# EasyEDA Pro project car1.eprj, schematic Schematic9
Board Name: V2.0-电源板; Create Date: 2025-06-19; Page Name: P1; Project Name: car1; Schematic Name: Schematic9; Update Date: 2025-06-21; Company: 嘉立创EDA; Page Size: A4; Version: V1.0
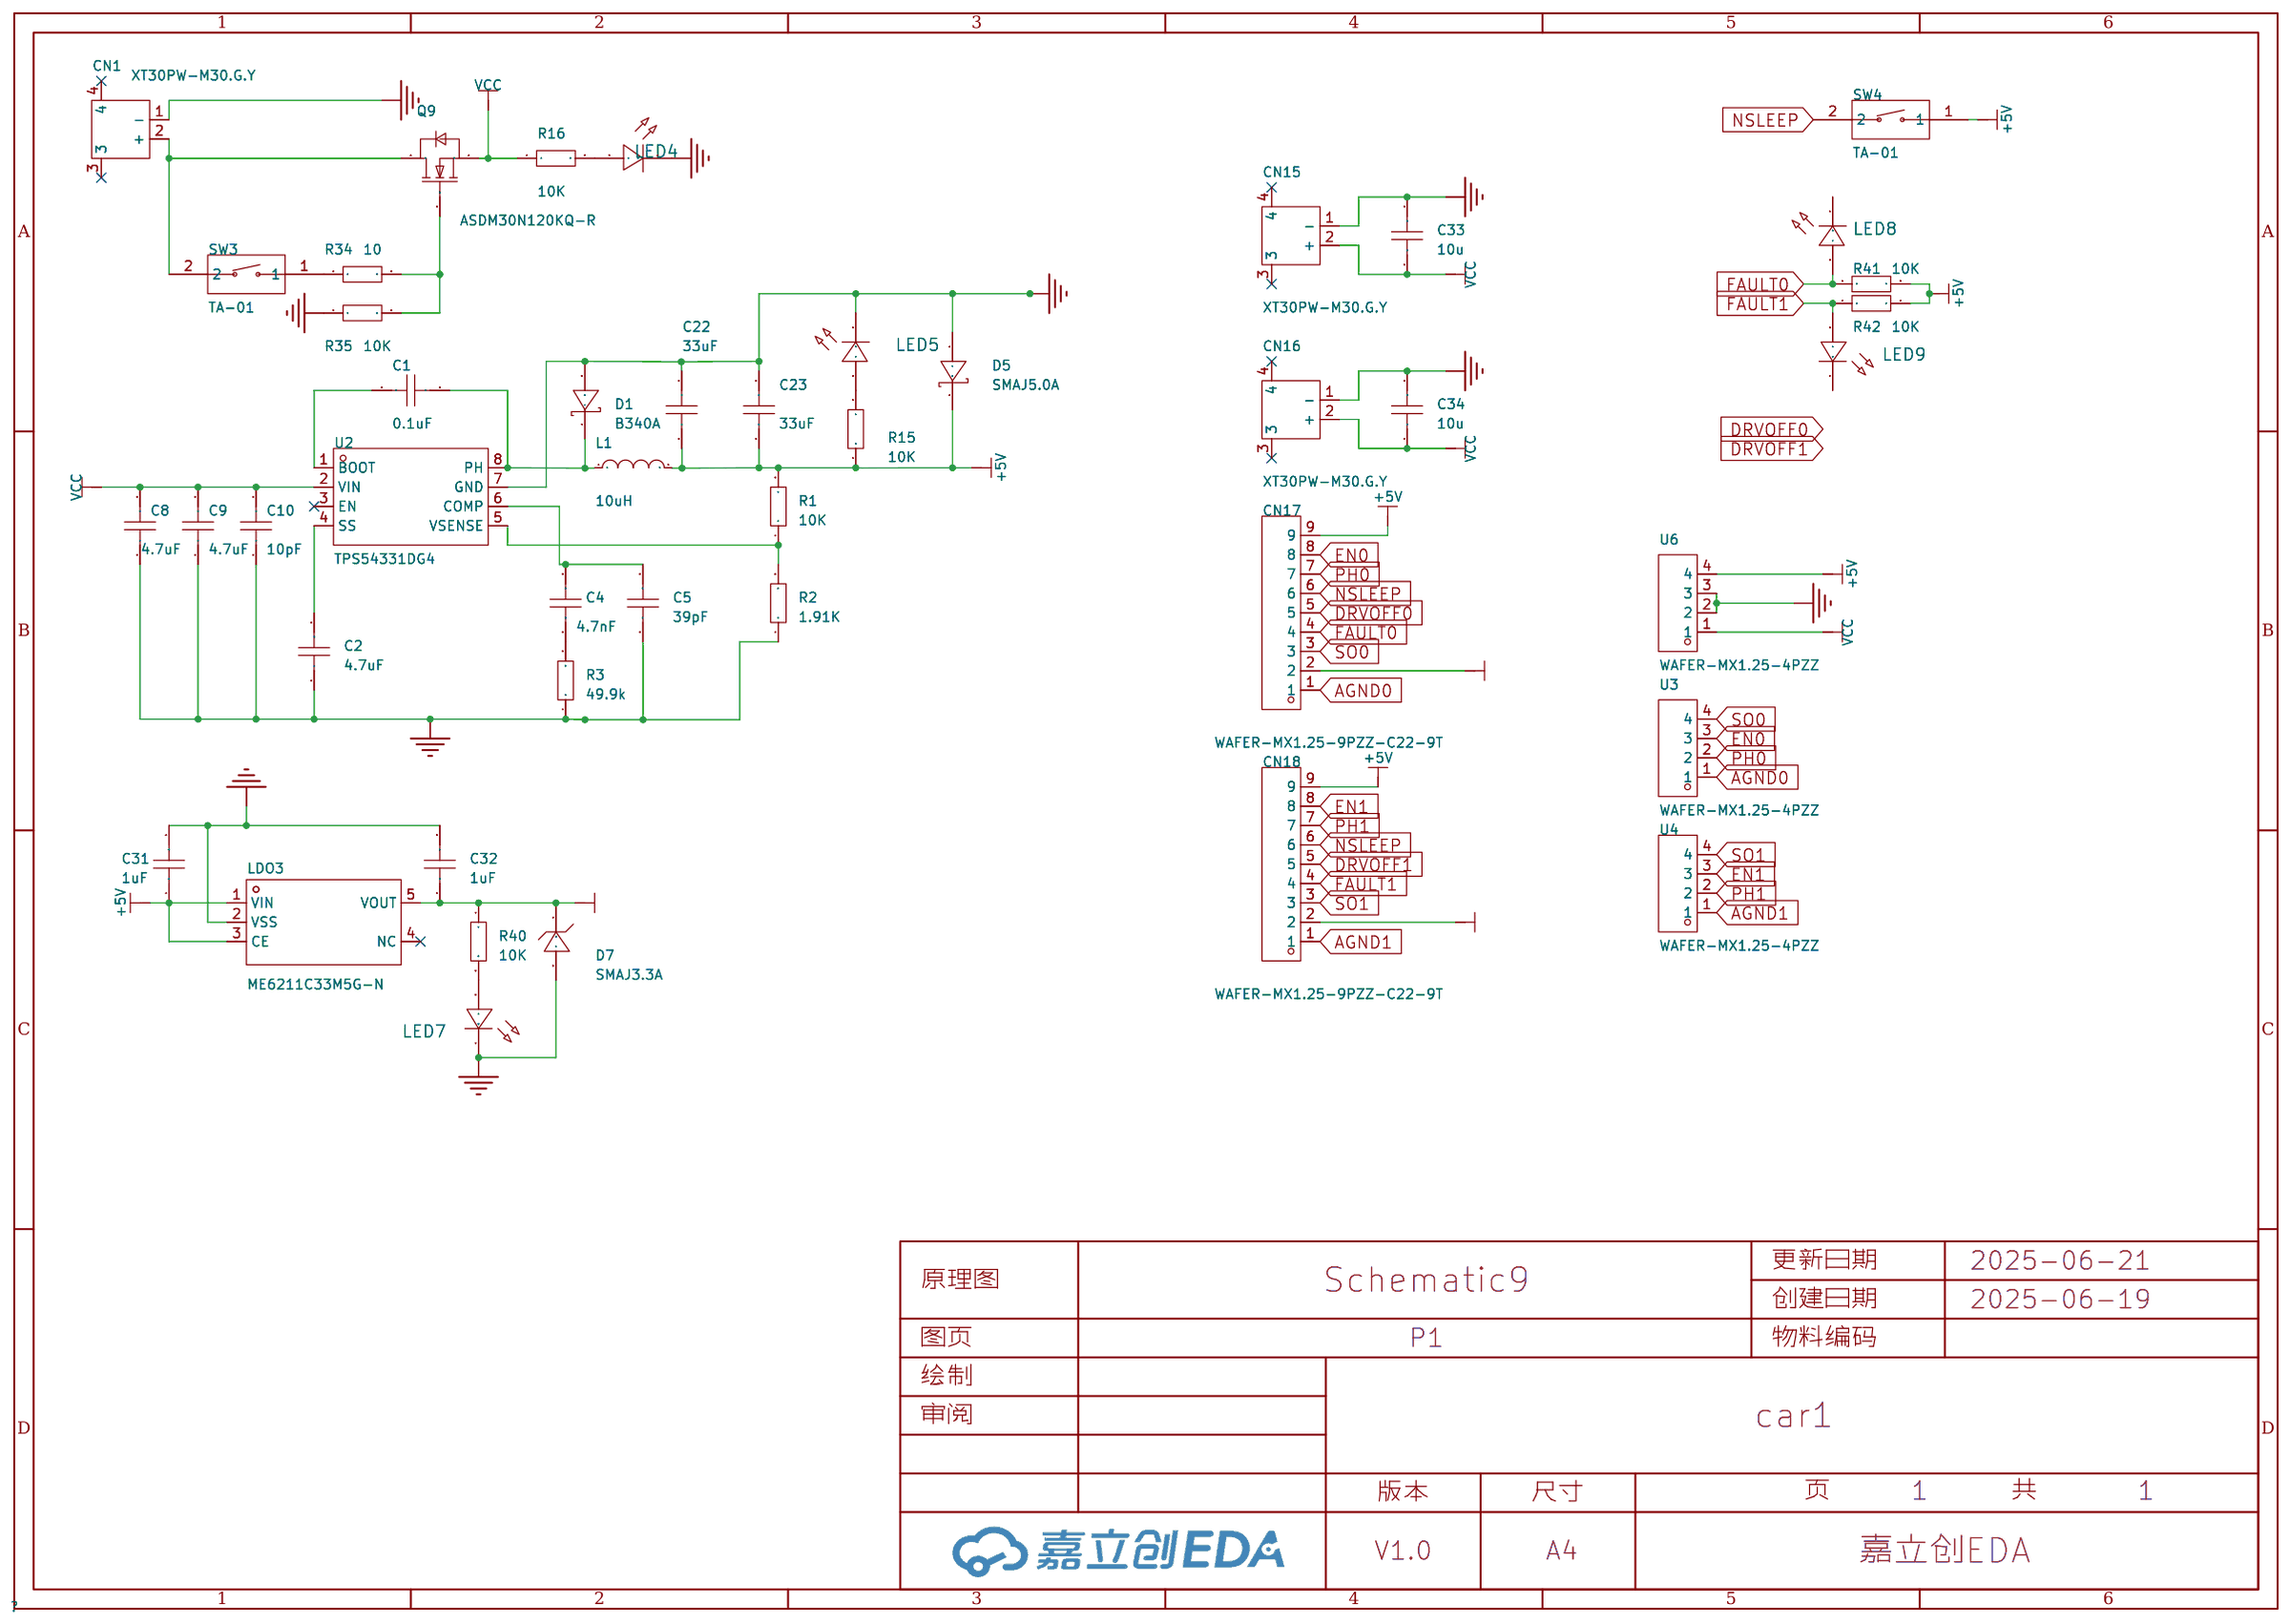
[diagram p13: schematic sheet]

## Parts
C1  0.1uF  [C0603]
C2  4.7uF  [C0603]
C4  4.7nF  [C0603]
C5  39pF  [C0603]
C8  4.7uF  [C0603]
C9  4.7uF  [C0603]
C10  10pF  [C0603]
C22  33uF  [C0603]
C23  33uF  [C0603]
C31  1uF  [C0603]
C32  1uF  [C0603]
C33  10u  [C1206]
C34  10u  [C1206]
CN1  XT30PW-M30.G.Y  [CONN-TH_XT30PW-M]
CN15  XT30PW-M30.G.Y  [CONN-TH_XT30PW-M]
CN16  XT30PW-M30.G.Y  [CONN-TH_XT30PW-M]
CN17  WAFER-MX1.25-9PZZ-C22-9T  [CONN-TH_WAFER-MX1.25-9PZZ-C22-9T]
CN18  WAFER-MX1.25-9PZZ-C22-9T  [CONN-TH_WAFER-MX1.25-9PZZ-C22-9T]
D1  B340A  [SMA_L4.3-W2.6-LS5.1-RD]
D5  SMAJ5.0A  [SMA_L4.4-W2.6-LS5.0-RD]
D7  SMAJ3.3A  [SMA_L4.3-W2.7-LS5.1-RD]
L1  10uH  [IND-SMD_L4.9-W4.4_MAPM0420F]
LDO3  ME6211C33M5G-N  [SOT-23-5_L3.0-W1.7-P0.95-LS2.8-BL]
LED4  -  [LED_0603]
LED5  -  [LED_0603]
LED7  -  [LED_0603]
LED8  -  [LED_0603]
LED9  -  [LED_0603]
Q9  ASDM30N120KQ-R  [TO-252-3_L6.5-W6.1-P4.58-TL]
R1  10K  [R0603]
R2  1.91K  [R0603]
R3  49.9k  [R0603]
R15  10K  [R0603]
R16  10K  [R0603]
R34  10  [R0603]
R35  10K  [R0603]
R40  10K  [R0603]
R41  10K  [R0603]
R42  10K  [R0603]
SW3  TA-01  [SW-TH_2P-L4.1-W9.6-P2.54-LS7.62]
SW4  TA-01  [SW-TH_2P-L4.1-W9.6-P2.54-LS7.62]
U2  TPS54331DG4  [SOIC-8_L4.9-W3.9-P1.27-LS6.0-BL]
U3  WAFER-MX1.25-4PZZ  [CONN-TH_4P-P1.25_WAFER-MX1.25-4PZZ]
U4  WAFER-MX1.25-4PZZ  [CONN-TH_4P-P1.25_WAFER-MX1.25-4PZZ]
U6  WAFER-MX1.25-4PZZ  [CONN-TH_4P-P1.25_WAFER-MX1.25-4PZZ]

## Library data of the parts
C1 = CAP_0402: MLCC; Supplier Footprint: 0402
C2 C4 C5 C8-C10 C31 C32 = CAP_0402: Supplier Footprint: 0402
C22 C23 = CAP_0603: Supplier Footprint: 0603
C33 C34 = CAP_1206: Supplier Footprint: 1206
CN1 CN15 CN16 = XT30PW-M30.G.Y: 类别:-;类型1:-;; LCSC Part Name: AMASS(艾迈斯)航模插头 卧式弯脚 XT30PW-M公头; Supplier Part: C431092; Manufacturer: AMASS(艾迈斯); JLCPCB Part Class: 扩展库; Datasheet: https://atta.szlcsc.com/upload/public/pdf/source/20220222/6A9F22F7850E25B33E1BE430ADF8560B.pdf; Supplier: LCSC; Type: 航模插头; RatedVoltage: DC 500V; InterfaceType: 公头; RatedCurrent: 15A; RecommendedWireGauge: 16/18/20AWG; contact resistance: 1.2mΩ; specifications: 2pin
CN17 CN18 = WAFER-MX1.25-9PZZ-C22-9T: 插针结构:1x9P;间距:1.25mm;安装方式:直插;总PIN数:9P;排数:1;每排PIN数:9;额定电流:1A;触头材质:黄铜;触头镀层:锡;工作温度范围:-25℃~+85℃;; LCSC Part Name: 1x9P 间距:1.25mm 直插; Supplier Part: C32713119; Manufacturer: Yuandi(元迪); Supplier Footprint: P=1.25mm; JLCPCB Part Class: 扩展库; Datasheet: https://atta.szlcsc.com/upload/public/pdf/source/20240723/F18D3C457440615DA2D6F1C22EE09465.pdf; Supplier: LCSC; Pins Structure: 1x9P; Pitch: 1.25mm; Mounting Style: 直插; Number of Pins: 9P; Number of Rows: 1; Number of PINs Per Row: 9; Current Rating (Max): 1A; Contact Material: 黄铜; Contact Plating: 锡; Operating Temperature Range: -25℃~+85℃; Rated Voltage (Max): 125V; Plastic Material: PA9T
D1 = B340A: 二极管配置:独立式;正向压降(Vf):550mV@3A;直流反向耐压(Vr):40V;整流电流:3A;; LCSC Part Name: 电压:40V 电流:3A; Supplier Part: C64982; Manufacturer: MDD(辰达半导体); Supplier Footprint: SMA(DO-214AC); JLCPCB Part Class: 扩展库; Datasheet: https://atta.szlcsc.com/upload/public/pdf/source/20240710/591710C3B34CDB7FE3DA92C119E6F598.pdf; Supplier: LCSC; Diode Configuration: 独立式; Forward Voltage (Vf@If): 550mV@3A; Reverse Voltage (Vr): 40V; Rectified Current: 3A; Reverse Leakage Current (Ir): 500uA@40V
D5 = SMAJ5.0A: 反向截止电压(Vrwm):5V;最大钳位电压:9.2V;峰值脉冲电流(Ipp):43.5A;击穿电压:6.4V;; LCSC Part Name: 单向TVS; Supplier Part: C143135; Manufacturer: FMS(美丽微); Supplier Footprint: SMA(DO-214AC); JLCPCB Part Class: 扩展库; Datasheet: https://atta.szlcsc.com/upload/public/pdf/source/20181207/C341549_5F4FA613B7C5DCDA93DF59C5632A7235.pdf; Supplier: LCSC; Reverse Stand-Off Voltage (Vrwm): 5V; Maximum Clamping Voltage: 9.2V; Peak Pulse Current (Ipp): 43.5A; Breakdown Voltage: 6.4V; Type: TVS
D7 = SMAJ3.3A: 反向截止电压(Vrwm):3.3V;钳位电压:8.3V;峰值脉冲电流(Ipp):25A;击穿电压:4.2V;; LCSC Part Name: 单向TVS 3.3V截止 25A峰值脉冲; Supplier Part: C2917853; Manufacturer: ZHIDE(志得); Supplier Footprint: SMA; JLCPCB Part Class: 扩展库; Datasheet: https://atta.szlcsc.com/upload/public/pdf/source/20211123/CCA4B0E600B5A566CDC39785DC4CF110.pdf; Supplier: LCSC; Reverse Stand-Off Voltage (Vrwm): 3.3V; Clamping Voltage: 8.3V; Peak Pulse Current (Ipp): 25A; Voltage - Breakdown: 4.2V; Reverse Leakage Current (Ir): 200uA; Type: TVS
L1 = HA42-4R7MT: 电感值:4.7uH;精度:±20%;额定电流:2A;饱和电流(Isat):3A;; LCSC Part Name: 4.7uH ±20% 3A; Supplier Part: C2936653; Manufacturer: FH(风华); Supplier Footprint: 0420; JLCPCB Part Class: 扩展库; Datasheet: https://atta.szlcsc.com/upload/public/pdf/source/20211228/DF5AAD1C624D1DACD739A51BD94418BC.pdf; Supplier: LCSC; Tolerance: ±20%; Rated Current: 2A; Saturation Current (Isat): 3A; DC Resistance (DCR): 150mΩ
LDO3 = ME6211C33M5G-N: 输出类型:固定;最大输入电压:6V;输出电压:3.3V;最大输出电流:500mA;电源纹波抑制比(PSRR):70dB;输出极性:正极;; LCSC Part Name: 输入6V 输出3.3V 500mA; Supplier Part: C82942; Manufacturer: MICRONE(南京微盟); Supplier Footprint: SOT-23-5; JLCPCB Part Class: 扩展库; Datasheet: https://atta.szlcsc.com/upload/public/pdf/source/20170918/C82942_1505727073070976520.pdf; Supplier: LCSC; Output Type: 固定; Maximum Input Voltage: 6V; Output Voltage: 3.3V; MAX Output Current: 500mA; Power Supply Rejection Ratio (PSRR): 70dB; Dropout Voltage: 260mV@(200mA); Output Polarity: 正极; Number of Outputs: 1
LED4 LED5 LED7-LED9 = LED_0603-R: Supplier Footprint: 0603
Q9 = ASDM30N120KQ-R: 类型:1个N沟道;漏源电压(Vdss):30V;连续漏极电流(Id):120A;导通电阻(RDS(on)@Vgs,Id):2.5mΩ@10V,30A;功率(Pd):45W;阈值电压(Vgs(th)@Id):1V@250uA;; LCSC Part Name: 1个N沟道 耐压:30V 电流:120A; Supplier Part: C2972858; Manufacturer: ASDsemi(安森德); Supplier Footprint: TO-252; JLCPCB Part Class: 扩展库; Datasheet: https://atta.szlcsc.com/upload/public/pdf/source/20220215/F4CF60705CEE8B1702CEE96B10933A1F.pdf; Supplier: LCSC; Type: 1个N沟道; Drain Source Voltage (Vdss): 30V; Continuous Drain Current (Id): 120A; Drain Source On Resistance (RDS(on)@Vgs,Id): 2.5mΩ@10V,30A; Power Dissipation (Pd): 45W; Gate Threshold Voltage (Vgs(th)@Id): 1V@250uA; Total Gate Charge (Qg@Vgs): 63nC@10V; Input Capacitance (Ciss@Vds): 2.921nF@15V; Reverse Transfer Capacitance (Crss@Vds): 416pF@15V; Operating Temperature: -55℃~+150℃
R1-R3 R15 R16 R40 = Res_0402: Supplier Footprint: 0402
R34 R35 R41 R42 = Res_0603: Supplier Footprint: 0603
SW3 SW4 = TA-01: LCSC Part Name: 拨码开关红色01P-180度1PIN间距2.54mm立式直插正拨平拨1位DIP; Supplier Part: C559136; Manufacturer: Yuandi(元迪); Supplier Footprint: 插件; JLCPCB Part Class: 扩展库; Datasheet: https://atta.szlcsc.com/upload/public/pdf/source/20210928/69C098594BEC9F56DCA9E231879E18D8.pdf; Supplier: LCSC
U2 = TPS54331DG4: 功能类型:降压型;输出类型:可调;输入电压:3.5V~28V;输出电压:800mV~25V;输出电流:3A;; Supplier Part: C1356164; Manufacturer: TI(德州仪器); Supplier Footprint: SOIC-8; JLCPCB Part Class: 扩展库; Datasheet: https://www.ti.com/cn/lit/gpn/tps54331; Supplier: LCSC; Function: 降压型; Output Type: 可调; Input Voltage: 3.5V~28V; Output Voltage: 800mV~25V; Output Current: 3A; Switching Frequency: 570kHz; Operating Temperature: -40℃~+150℃@(TJ); Synchronous Rectification: 否; Number of Outputs: 1; Topology: 降压式; Switch tube (built-in/external): 内置
U3 U4 U6 = WAFER-MX1.25-4PZZ: 插针结构:1x4P;间距:1.25mm;安装方式:直插;参考系列:PicoBlade(MX 1.25);总PIN数:4P;排数:1;每排PIN数:4;行距:-;额定电流:1A;触头材质:黄铜;触头镀层:-;工作温度:-25℃~+85℃;; LCSC Part Name: 1x4P 间距:1.25mm 直插 系列:PicoBlade(MX 1.25); Supplier Part: C3029397; Manufacturer: XUNPU(讯普); Supplier Footprint: 插件,P=1.25mm; JLCPCB Part Class: 扩展库; Datasheet: https://atta.szlcsc.com/upload/public/pdf/source/20220527/74EE44A637E2E6AE073051F308D41465.pdf; Supplier: LCSC; Pins Structure: 1x4P; Pitch: 1.25mm; Mounting Type: 直插; Reference Series: PicoBlade(MX 1.25); Number of Pins: 4P; Number of Rows: 1; Number of PINs Per Row: 4; Current Rating: 1A; Contact Material: 黄铜; Operating Temperature: -25℃~+85℃; Voltage Rating: 125V; Plastic Material: LCP; Color: 米色; Z-Height of the Board: 4.6mm; Y-Width of Bottom Edge on Board: 3.3mm

## Nets
3.3V_1: C32.1 CN17.2 CN18.2 D7.1(C) LDO3.5(VOUT) R40.1
+5V: C23.1 C31.1 CN17.9 CN18.9 D5.1(K) LDO3.1(VIN) LDO3.3(CE) R1.2 R15.1 R41.2 R42.2 SW4.1 U6.4
AGND0: CN17.1 U3.1
AGND1: CN18.1 U4.1
GND: C2.1 C5.1 C8.1 C9.1 C10.1 C22.1 C23.2 C31.2 C32.2 C33.2 C34.2 CN1.1(-) CN15.1(-) CN16.1(-) D1.2(A) D5.2(A) D7.2(A) LDO3.2(VSS) LED4.1(C) LED5.1(C) LED7.1(C) R2.1 R3.1 R35.1 U2.7(GND) U6.2 U6.3
VCC: C8.2 C9.2 C10.2 C33.1 C34.1 CN15.2(+) CN16.2(+) Q9.3(S) R16.1 U2.2(VIN) U6.1
DRVOFF0: CN17.5
DRVOFF1: CN18.5
EN0: CN17.8 U3.3
EN1: CN18.8 U4.3
FAULT0: CN17.4 LED8.2(A) R41.1
FAULT1: CN18.4 LED9.2(A) R42.1
NSLEEP: CN17.6 CN18.6 SW4.2
PH0: CN17.7 U3.2
PH1: CN18.7 U4.2
SO0: CN17.3 U3.4
SO1: CN18.3 U4.4
$1N1351: C1.2 U2.1(BOOT)
$1N1353: C2.2 U2.4(SS)
$1N1357: R1.1 R2.2 U2.5(VSENSE)
$1N1358: C4.2 C5.2 U2.6(COMP)
$1N1359: C4.1 R3.2
$1N1366: LED4.2(A) R16.2
$1N1367: LED5.2(A) R15.2
$1N1372: R34.1 SW3.1
$1N1373: Q9.1(G) R34.2 R35.2
$1N1378: LED7.2(A) R40.2
$1N6937: CN1.2(+) Q9.2(D) SW3.2
Net-(C1-1): C1.1 D1.1(K) U2.8(PH)

Not connected (* = marked no-connect by the designer): C22 2; CN1 3* 4*; CN15 3* 4*; CN16 3* 4*; L1 1 2; LDO3 4(NC)*; LED8 1(C); LED9 1(C); U2 3(EN)*
